# EAGLE design DUAL POWER SUPPLY (EAGLE 9.6.2)
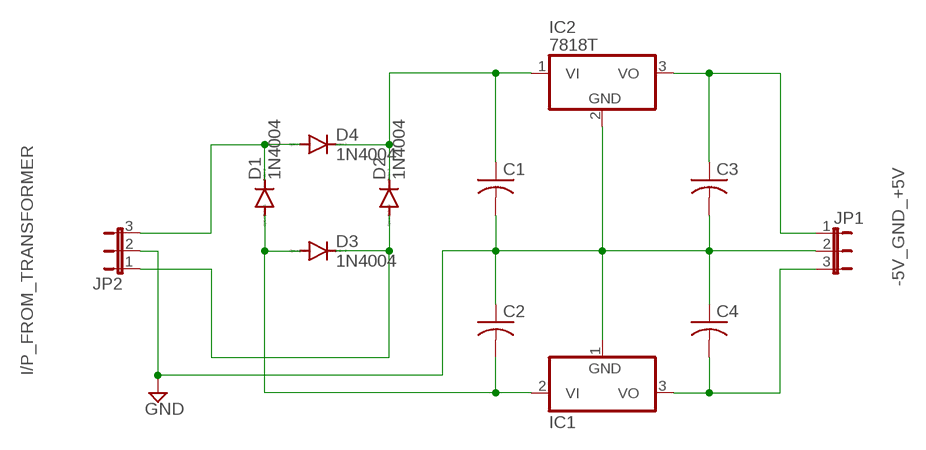
[diagram p0: schematic, sheet 1]

## Parts
C1  C-US025-024X044  [C025-024X044]
C2  C-US025-024X044  [C025-024X044]
C3  C-US025-024X044  [C025-024X044]
C4  C-US025-024X044  [C025-024X044]
D1  1N4004  [DO41-10]
D2  1N4004  [DO41-10]
D3  1N4004  [DO41-10]
D4  1N4004  [DO41-10]
IC1  79L05Z  [TO92]
IC2  7818T  [TO220H]
JP1  JP2E  [JP2]
JP2  JP2E  [JP2]

## Nets
GND: C1.2 C2.1 C3.2 C4.1 IC1.1(GND) IC2.2(GND) JP1.2 JP2.2
N$1: D1.C D4.A JP2.3
N$2: C1.1 D2.C D4.C IC2.1(VI)
N$3: D2.A D3.C JP2.1
N$9: C2.2 D1.A D3.A IC1.2(VI)
N$10: C3.1 IC2.3(VO) JP1.1
N$11: C4.2 IC1.3(VO) JP1.3

## Notes on the sheet
- -5V_GND_+5V
- I/P_FROM_TRANSFORMER

## Library data of the parts
C1-C4 = rcl:C-US: CAPACITOR, American symbol; SPICEPREFIX: C
D1-D4 = diode:1N4004: DIODE general purpose rectifier, 1 A
IC1 = linear:79*: Negative VOLTAGE REGULATOR
IC2 = linear:78*: Positive VOLTAGE REGULATOR Source: http://cache.national.com/ds/LM/LM78L05.pdf http://www.fairchildsemi.com/ds/LM/LM7805.pdf
JP1 JP2 = jumper:JP2E: JUMPER

## Board
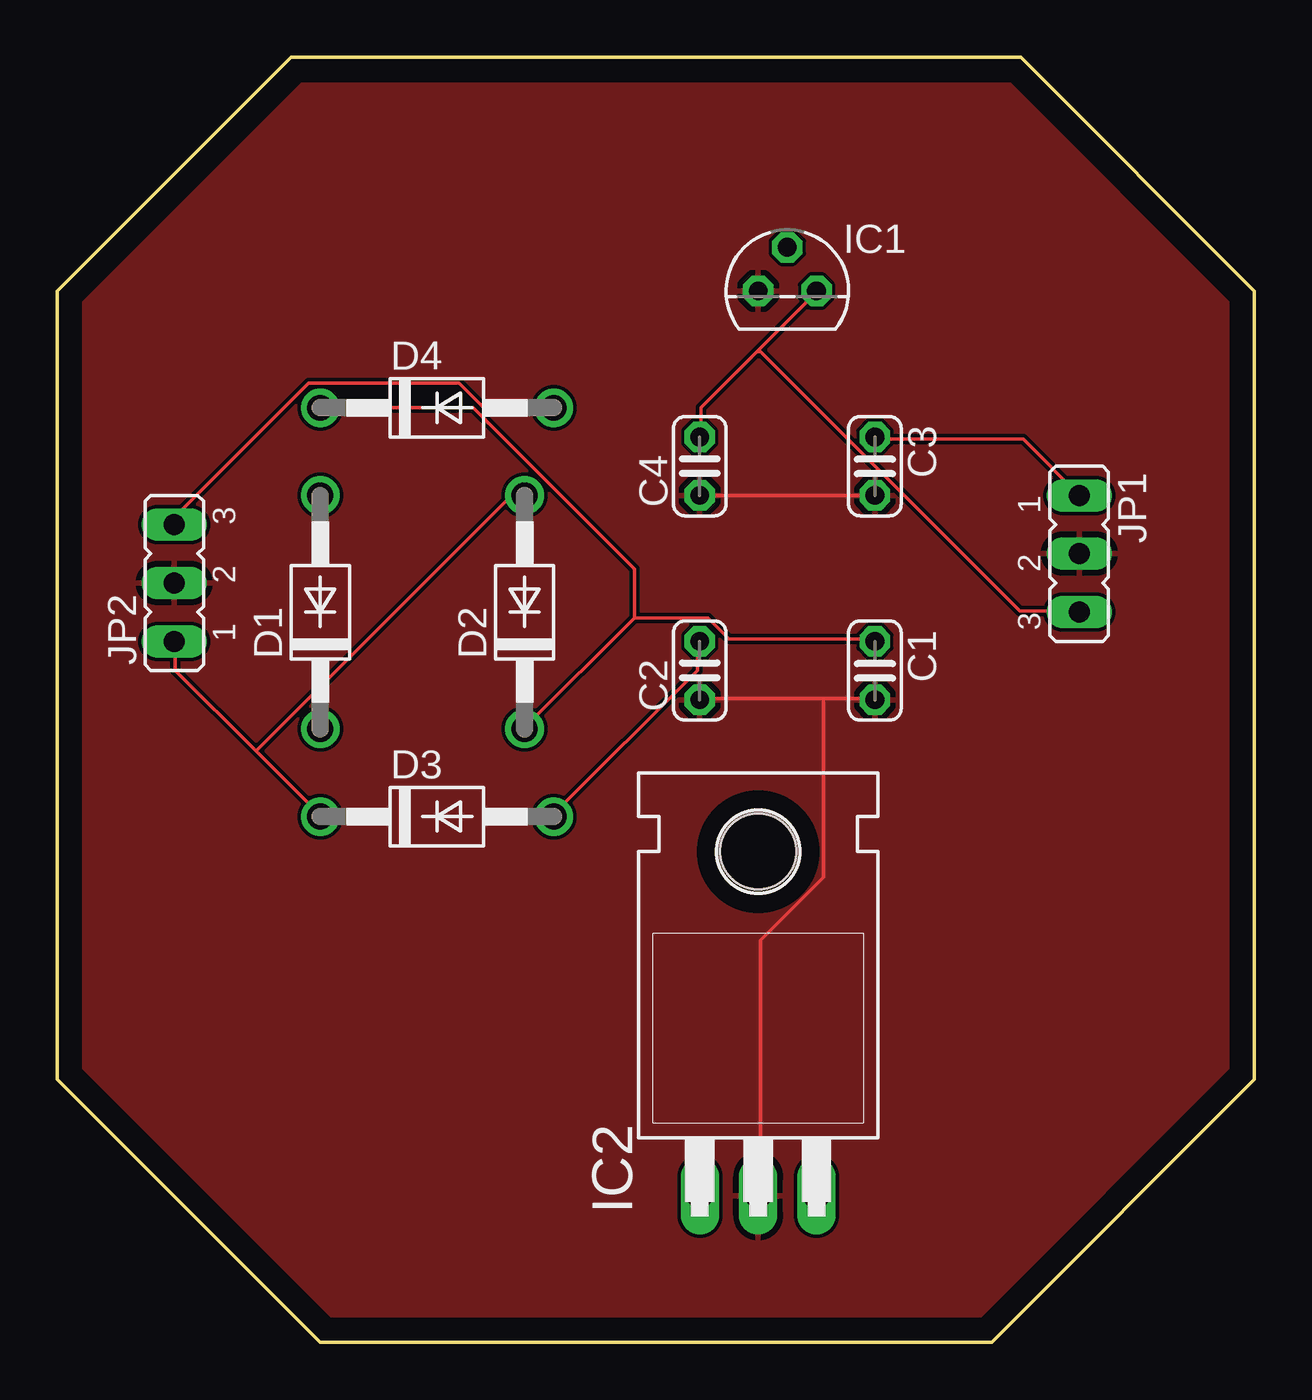
[diagram p1: board, top side]
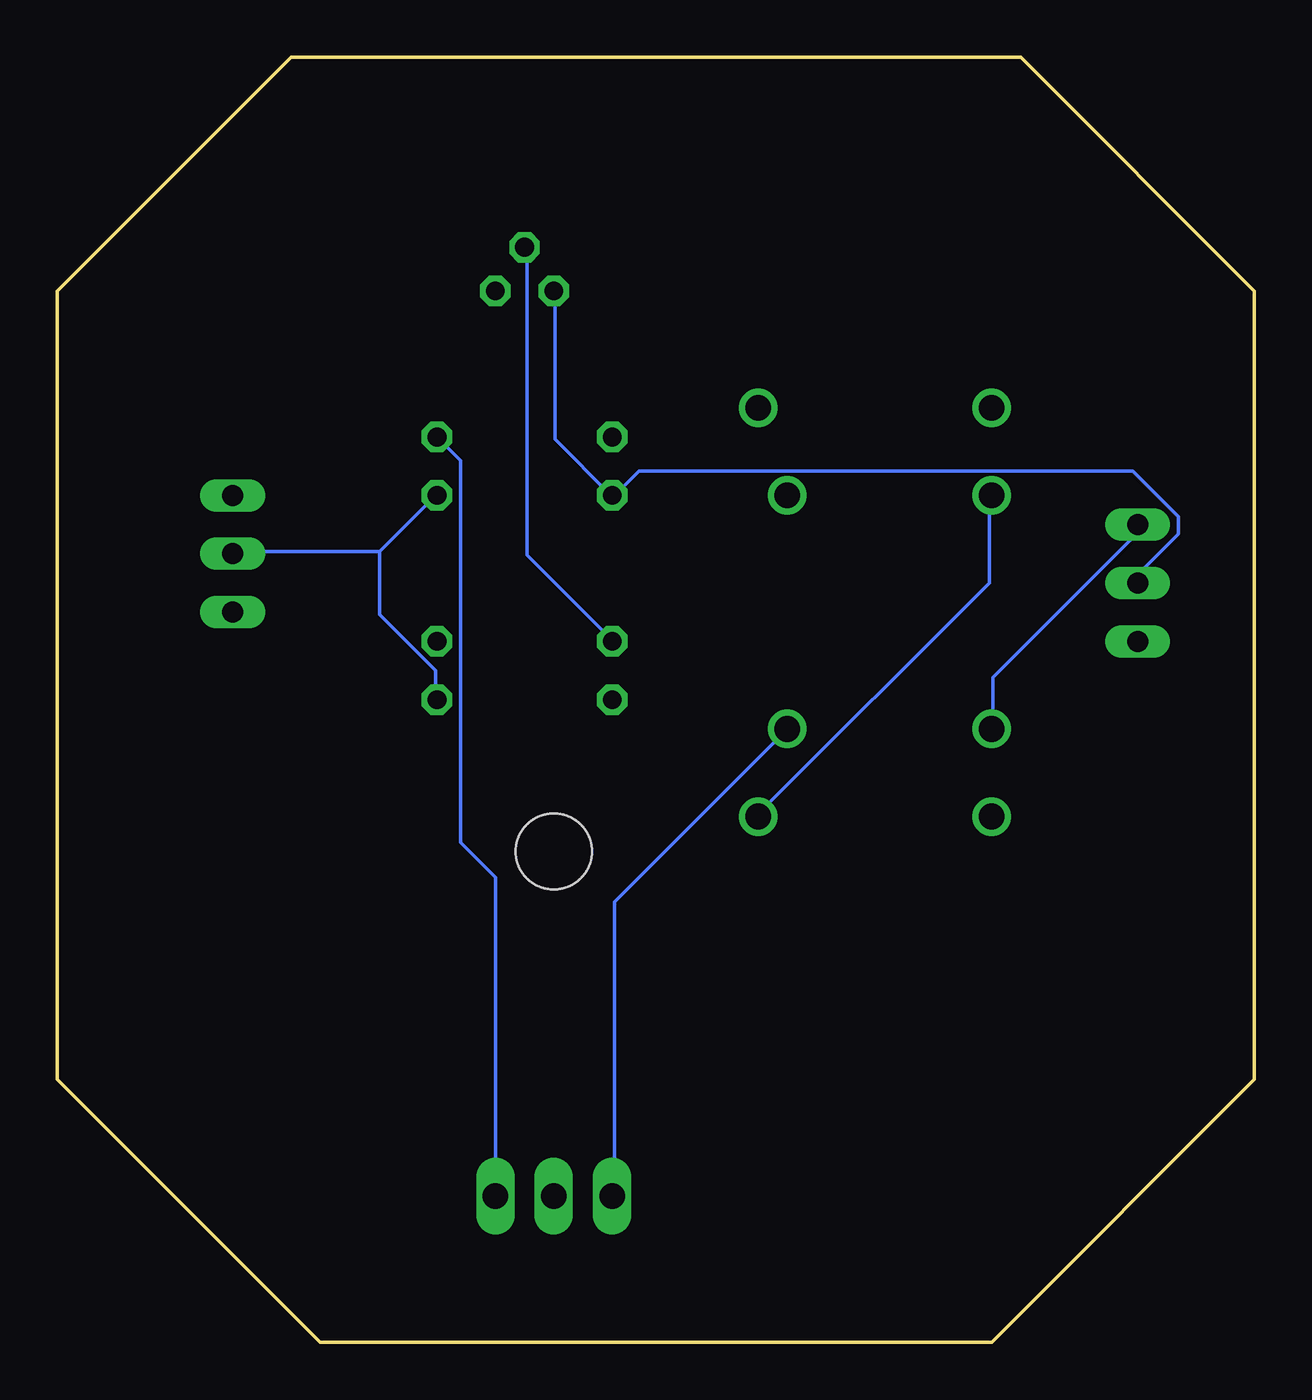
[diagram p2: board, bottom side, seen from below]

Size 52.07 x 55.88 mm. Coordinates in mm from the lower left corner, seen from the top.
Outline: 52.07,45.72 52.07,11.43 40.64,0 11.43,0 0,11.43 0,45.72 10.16,55.88 41.91,55.88 52.07,45.72
Copper layers (1*16): Top 0.035mm / dielectric 1.5mm / Bottom 0.035mm
Design rules "default": minimum track width 6mil, minimum drill 0.35mm, track to track 6mil, track to pad 6mil, pad to pad 6mil, via to via 6mil, smd to smd 6mil, copper to edge 40mil, drill to drill 6mil, minimum pad ring 10mil, minimum via ring 8mil, stop-mask expansion 4mil, vias tented up to drill 0mil, thermal gap 10mil

### Footprints (pad centres in the part's own frame; a part is rotated, then mirrored left to right if it is on the bottom)
C025-024X044 = drill 0.813 octagon: 1 -1.27,0; 2 1.27,0
DO41-10 = drill 1.118: A 5.08,0; C -5.08,0
TO92 = drill 0.813 octagon: 1 -1.27,0; 2 0,1.905; 3 1.27,0
TO220H = drill 1.118 long: 1 -2.54,-10.16; 2 0,-10.16; 3 2.54,-10.16 | hole 3.302: 0,4.826
JP2 = drill 0.914 long: 1 -2.54,0; 2 0,0; 3 2.54,0

### Placement (x,y rotation side)
C1  35.56,29.21 270 top
C2  27.94,29.21 90 top
C3  35.56,38.1 270 top
C4  27.94,38.1 90 top
D1  11.43,31.75 90 top
D2  20.32,31.75 90 top
D3  16.51,22.86 0 top
D4  16.51,40.64 0 top
IC1  31.75,45.72 0 top
IC2  30.48,16.51 0 top
JP1  44.45,34.29 270 top
JP2  5.08,33.02 90 top

### Tracks (layer width: path | path; a pad name or v marks a point on that pad's centre or on a via)
GND
  Top 0.152: 33.33,27.99 35.46,27.99 C1.2 | 33.33,27.99 27.99,27.99 C2.1 | 33.33,27.99 33.33,20.22 30.58,17.48 30.58,6.35 IC2.2 | C3.2 C4.1
  Bottom 0.152: IC1.1 30.43,45.67 30.43,39.27 27.99,36.83 C4.1 27.84,36.83 26.77,37.9 5.28,37.9 3.3,35.92 3.3,35.15 4.98,33.48 4.98,33.02 JP2.2 | 38.05,34.39 44.45,34.39 JP1.2 | 38.05,34.39 35.61,36.83 C3.2 | 38.05,34.39 38.05,31.65 35.61,29.21 35.61,27.99 C1.2
  pour Top: 57.15,-1.27 57.15,58.42 -6.35,58.42 -6.35,-1.27 -3.81,-1.27
N$1
  Top 0.152: D4.A 18.54,40.64 17.48,41.71 10.92,41.71 5.13,35.92 5.13,35.61 JP2.3
  Bottom 0.152: JP2.3 5.13,35.46 5.13,35.15 11.38,28.91 11.38,26.77 D1.C
N$2
  Top 0.152: 25.09,31.5 28.3,31.5 29.21,30.58 35.46,30.58 C1.1 | 25.09,31.5 20.37,26.77 D2.C | D4.C 18.09,40.64 25.09,33.63 25.09,31.5
  Bottom 0.152: D2.C 27.84,19.15 27.84,6.35 IC2.1
N$3
  Top 0.152: 8.64,25.7 11.38,22.96 D3.C | 8.64,25.7 5.13,29.21 5.13,30.43 JP2.1 | D2.A 19.76,36.83 8.64,25.7
N$9
  Top 0.152: C2.2 27.84,30.43 27.84,29.21 21.59,22.96 D3.A
  Bottom 0.152: IC1.2 31.65,47.5 31.65,34.24 27.99,30.58 C2.2 | D1.A 11.53,36.83 11.53,33.02 21.59,22.96 D3.A
N$10
  Top 0.152: JP1.1 42.01,39.27 35.61,39.27 C3.1
  Bottom 0.152: IC2.3 33.02,20.22 34.54,21.74 34.54,38.35 C3.1
N$11
  Top 0.152: 30.43,43.08 33.02,45.67 IC1.3 | 30.43,43.08 27.99,40.64 27.99,39.42 C4.2 | 30.43,43.08 30.58,43.08 41.86,31.8 44.45,31.8 JP1.3